# EAGLE schematic audio_mixer (EAGLE 9.3.0)
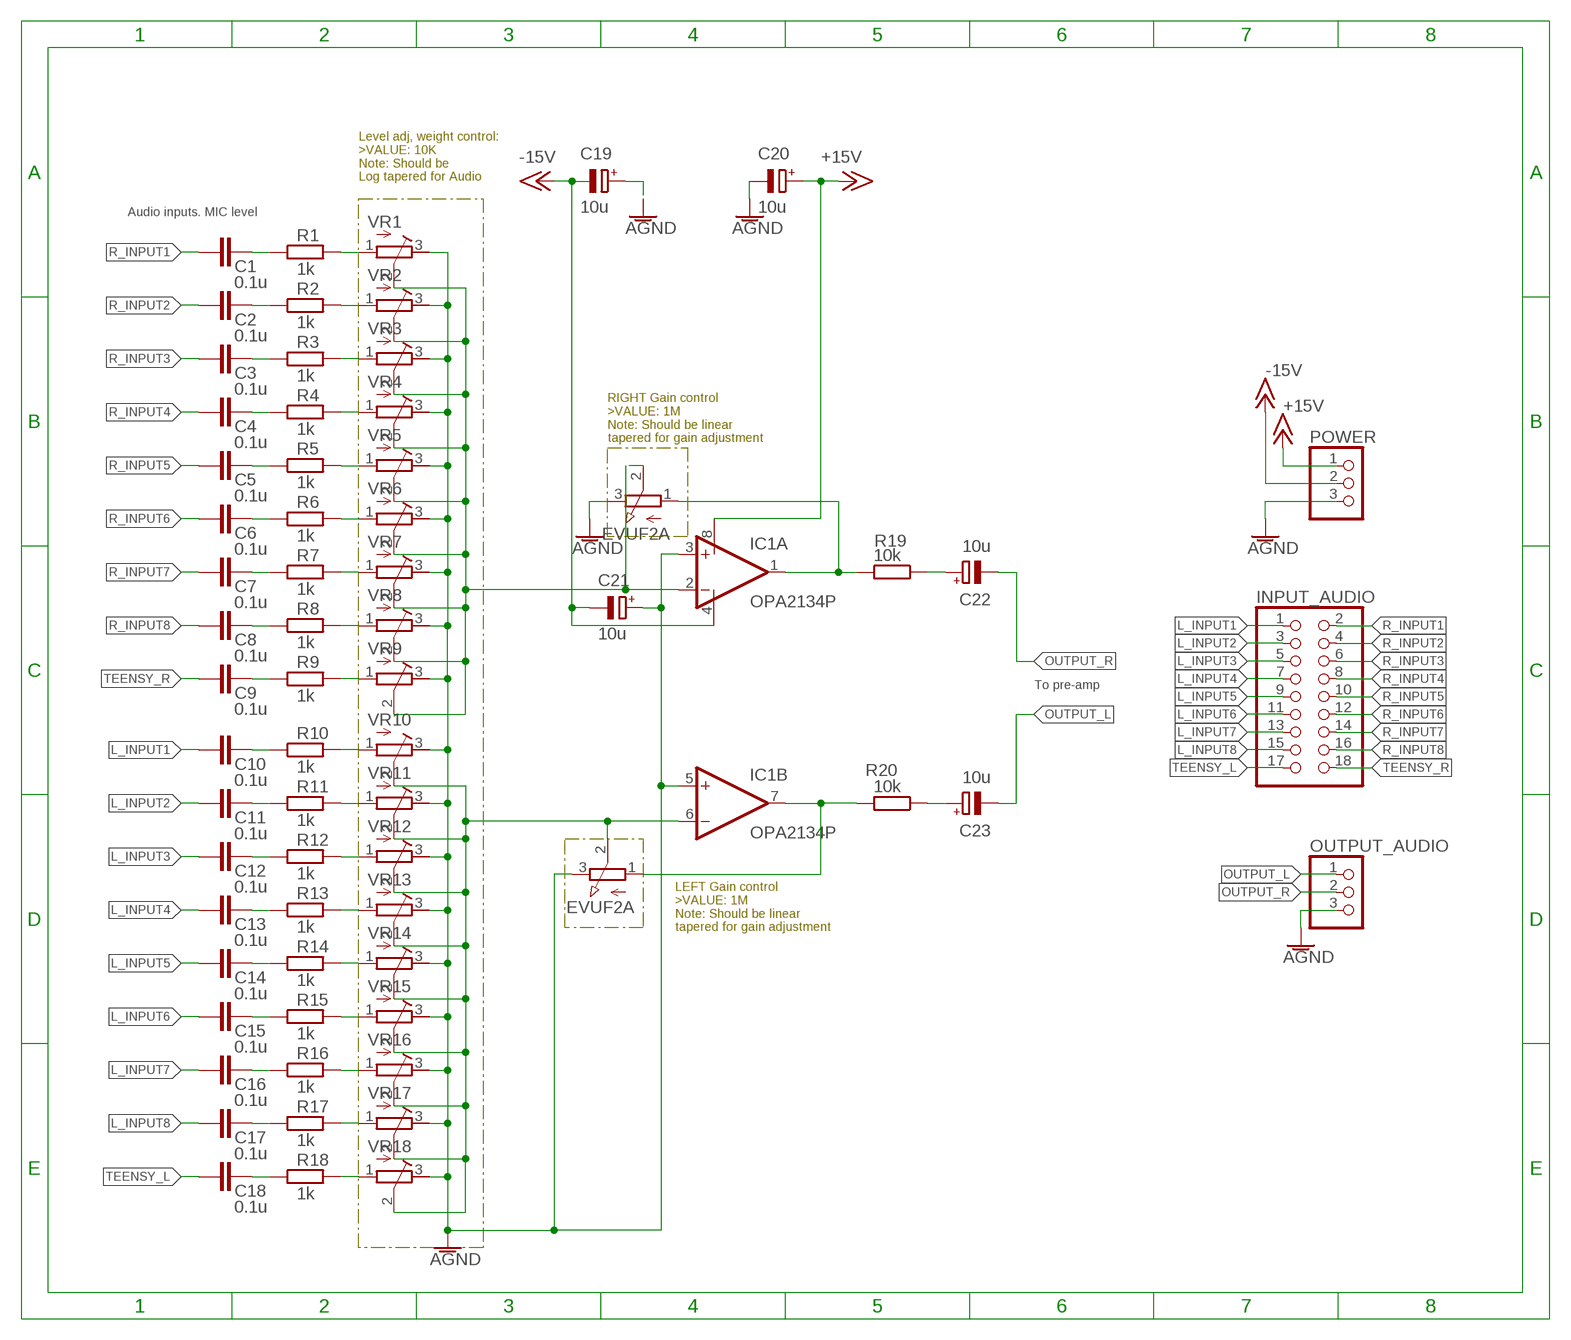
[diagram p0: schematic, sheet 1]

## Parts
C1  0.1u  C-EU025-030X050  [C025-030X050]
C2  0.1u  C-EU025-030X050  [C025-030X050]
C3  0.1u  C-EU025-030X050  [C025-030X050]
C4  0.1u  C-EU025-030X050  [C025-030X050]
C5  0.1u  C-EU025-030X050  [C025-030X050]
C6  0.1u  C-EU025-030X050  [C025-030X050]
C7  0.1u  C-EU025-030X050  [C025-030X050]
C8  0.1u  C-EU025-030X050  [C025-030X050]
C9  0.1u  C-EU025-030X050  [C025-030X050]
C10  0.1u  C-EU025-030X050  [C025-030X050]
C11  0.1u  C-EU025-030X050  [C025-030X050]
C12  0.1u  C-EU025-030X050  [C025-030X050]
C13  0.1u  C-EU025-030X050  [C025-030X050]
C14  0.1u  C-EU025-030X050  [C025-030X050]
C15  0.1u  C-EU025-030X050  [C025-030X050]
C16  0.1u  C-EU025-030X050  [C025-030X050]
C17  0.1u  C-EU025-030X050  [C025-030X050]
C18  0.1u  C-EU025-030X050  [C025-030X050]
C19  10u  CPOL-EUE5-10.5  [E5-10,5]
C20  10u  CPOL-EUE5-10.5  [E5-10,5]
C21  10u  CPOL-EUE5-10.5  [E5-10,5]
C22  10u  CPOL-EUE5-10.5  [E5-10,5]
C23  10u  CPOL-EUE5-10.5  [E5-10,5]
IC1  OPA2134P  [DIL08]
INPUT_AUDIO  PINHD-2X9  [2X09]
OUTPUT_AUDIO  PINHD-1X3  [1X03]
POWER  PINHD-1X3  [1X03]
R1  1k  R-EU_R0805  [R0805]
R2  1k  R-EU_R0805  [R0805]
R3  1k  R-EU_R0805  [R0805]
R4  1k  R-EU_R0805  [R0805]
R5  1k  R-EU_R0805  [R0805]
R6  1k  R-EU_R0805  [R0805]
R7  1k  R-EU_R0805  [R0805]
R8  1k  R-EU_R0805  [R0805]
R9  1k  R-EU_R0805  [R0805]
R10  1k  R-EU_R0805  [R0805]
R11  1k  R-EU_R0805  [R0805]
R12  1k  R-EU_R0805  [R0805]
R13  1k  R-EU_R0805  [R0805]
R14  1k  R-EU_R0805  [R0805]
R15  1k  R-EU_R0805  [R0805]
R16  1k  R-EU_R0805  [R0805]
R17  1k  R-EU_R0805  [R0805]
R18  1k  R-EU_R0805  [R0805]
R19  10k  R-EU_R0805  [R0805]
R20  10k  R-EU_R0805  [R0805]
VR1  R-TRIMM3339P  [RTRIM3339P]
VR2  R-TRIMM3339P  [RTRIM3339P]
VR3  R-TRIMM3339P  [RTRIM3339P]
VR4  R-TRIMM3339P  [RTRIM3339P]
VR5  R-TRIMM3339P  [RTRIM3339P]
VR6  R-TRIMM3339P  [RTRIM3339P]
VR7  R-TRIMM3339P  [RTRIM3339P]
VR8  R-TRIMM3339P  [RTRIM3339P]
VR9  R-TRIMM3339P  [RTRIM3339P]
VR10  R-TRIMM3339P  [RTRIM3339P]
VR11  R-TRIMM3339P  [RTRIM3339P]
VR12  R-TRIMM3339P  [RTRIM3339P]
VR13  R-TRIMM3339P  [RTRIM3339P]
VR14  R-TRIMM3339P  [RTRIM3339P]
VR15  R-TRIMM3339P  [RTRIM3339P]
VR16  R-TRIMM3339P  [RTRIM3339P]
VR17  R-TRIMM3339P  [RTRIM3339P]
VR18  R-TRIMM3339P  [RTRIM3339P]
VR19  EVUF2A  [EVUF]
VR20  EVUF2A  [EVUF]

## Nets
+15V: C20.+ IC1.8(P:V+) POWER.1
-15V: C19.- C21.- IC1.4(P:V-) POWER.2
AGND: C19.+ C20.- C21.+ IC1.3(A:+IN) IC1.5(B:+IN) OUTPUT_AUDIO.3 POWER.3 VR1.3(E) VR2.3(E) VR3.3(E) VR4.3(E) VR5.3(E) VR6.3(E) VR7.3(E) VR8.3(E) VR9.3(E) VR10.3(E) VR11.3(E) VR12.3(E) VR13.3(E) VR14.3(E) VR15.3(E) VR16.3(E) VR17.3(E) VR18.3(E) VR19.3(E) VR20.3(E)
L_INPUT1: C10.2 INPUT_AUDIO.1
L_INPUT2: C11.2 INPUT_AUDIO.3
L_INPUT3: C12.2 INPUT_AUDIO.5
L_INPUT4: C13.2 INPUT_AUDIO.7
L_INPUT5: C14.2 INPUT_AUDIO.9
L_INPUT6: C15.2 INPUT_AUDIO.11
L_INPUT7: C16.2 INPUT_AUDIO.13
L_INPUT8: C17.2 INPUT_AUDIO.15
L_OP_IN: IC1.6(B:-IN) VR10.2(S) VR11.2(S) VR12.2(S) VR13.2(S) VR14.2(S) VR15.2(S) VR16.2(S) VR17.2(S) VR18.2(S) VR20.2(S)
LEFT_OP_OUT: IC1.7(B:OUT) R20.2 VR20.1(A)
N$1: C4.1 R4.1
N$2: C22.+ R19.1
N$3: C1.1 R1.1
N$4: C2.1 R2.1
N$5: C3.1 R3.1
N$6: C9.1 R9.1
N$7: R9.2 VR9.1(A)
N$8: C10.1 R10.1
N$9: R10.2 VR10.1(A)
N$10: R3.2 VR3.1(A)
N$11: C11.1 R11.1
N$13: R1.2 VR1.1(A)
N$14: R4.2 VR4.1(A)
N$15: C12.1 R12.1
N$16: C13.1 R13.1
N$17: R13.2 VR13.1(A)
N$18: R2.2 VR2.1(A)
N$20: C23.+ R20.1
N$21: R11.2 VR11.1(A)
N$23: R12.2 VR12.1(A)
N$25: C5.1 R5.1
N$26: C6.1 R6.1
N$27: C7.1 R7.1
N$28: R7.2 VR7.1(A)
N$29: R5.2 VR5.1(A)
N$30: R6.2 VR6.1(A)
N$31: C8.1 R8.1
N$32: R8.2 VR8.1(A)
N$35: C14.1 R14.1
N$36: R14.2 VR14.1(A)
N$39: C15.1 R15.1
N$40: C16.1 R16.1
N$41: C17.1 R17.1
N$42: R17.2 VR17.1(A)
N$43: R15.2 VR15.1(A)
N$44: R16.2 VR16.1(A)
N$45: C18.1 R18.1
N$46: R18.2 VR18.1(A)
OUTPUT_L: C23.- OUTPUT_AUDIO.1
OUTPUT_R: C22.- OUTPUT_AUDIO.2
R_INPUT1: C1.2 INPUT_AUDIO.2
R_INPUT2: C2.2 INPUT_AUDIO.4
R_INPUT3: C3.2 INPUT_AUDIO.6
R_INPUT4: C4.2 INPUT_AUDIO.8
R_INPUT5: C5.2 INPUT_AUDIO.10
R_INPUT6: C6.2 INPUT_AUDIO.12
R_INPUT7: C7.2 INPUT_AUDIO.14
R_INPUT8: C8.2 INPUT_AUDIO.16
R_OP_IN: IC1.2(A:-IN) VR1.2(S) VR2.2(S) VR3.2(S) VR4.2(S) VR5.2(S) VR6.2(S) VR7.2(S) VR8.2(S) VR9.2(S) VR19.2(S)
RIGHT_OP_OUT: IC1.1(A:OUT) R19.2 VR19.1(A)
TEENSY_L: C18.2 INPUT_AUDIO.17
TEENSY_R: C9.2 INPUT_AUDIO.18

## Notes on the sheet
- Level adj, weight control:
  >VALUE: 10K
  Note: Should be
  Log tapered for Audio
- Audio inputs. MIC level
- RIGHT Gain control
  >VALUE: 1M
  Note: Should be linear
  tapered for gain adjustment
- To pre-amp
- LEFT Gain control
  >VALUE: 1M
  Note: Should be linear
  tapered for gain adjustment

## Library data of the parts
C1-C18 = rcl:C-EU: CAPACITOR, European symbol; SPICEPREFIX: C
C19-C23 = rcl:CPOL-EU: POLARIZED CAPACITOR, European symbol; SPICEPREFIX: C
IC1 = linear:OPA2134: SoundPLUS (TM) High Performance AUDIO OPERATIONAL AMPLIFIERS Source: http://focus.ti.com/lit/ds/sbos058/sbos058.pdf
INPUT_AUDIO = pinhead:PINHD-2X9: PIN HEADER
OUTPUT_AUDIO POWER = pinhead:PINHD-1X3: PIN HEADER
R1-R20 = rcl:R-EU_: RESISTOR, European symbol; SPICEPREFIX: R
VR1-VR18 = rcl:R-TRIMM: Trimm resistor; SPICEMODEL: X; SPICEPREFIXL: POT
VR19 VR20 = pot:EVU: 9 mm Square Rotary Potentiometers Source: Panasonic